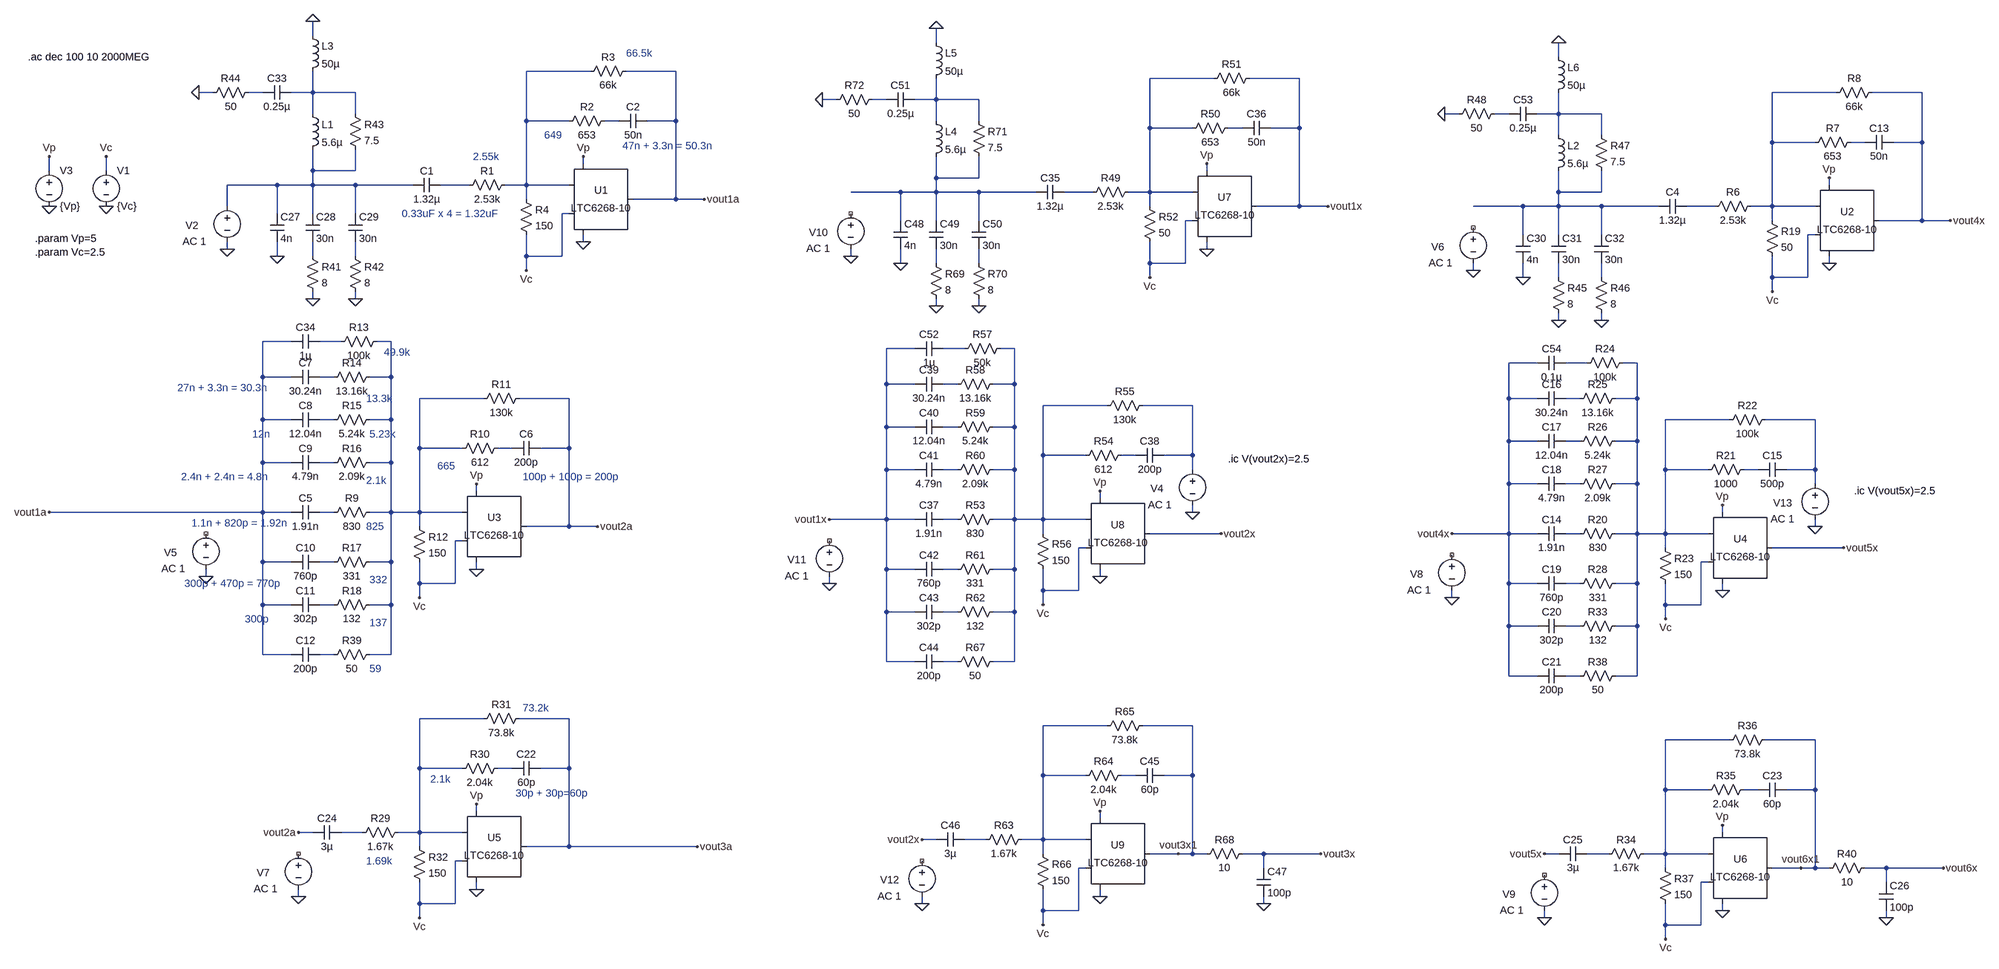
[diagram p0: schematic 3stagecompensator_localloopgainchecks_20211019 - save 1.asc]
3stagecompensator_localloopgainchecks_20211019 - save 1.asc, the LTspice schematic file:
Version 4
SHEET 1 4224 2536
WIRE -400 -304 -400 -336
WIRE 1216 -288 1216 -320
WIRE 2848 -256 2848 -288
WIRE 224 -224 80 -224
WIRE 416 -224 304 -224
WIRE 1840 -208 1696 -208
WIRE 2032 -208 1920 -208
WIRE -624 -176 -656 -176
WIRE -512 -176 -544 -176
WIRE -400 -176 -400 -224
WIRE -400 -176 -448 -176
WIRE -304 -176 -400 -176
WIRE 3472 -176 3328 -176
WIRE 3664 -176 3552 -176
WIRE 992 -160 960 -160
WIRE 1104 -160 1072 -160
WIRE 1216 -160 1216 -208
WIRE 1216 -160 1168 -160
WIRE 1312 -160 1216 -160
WIRE -400 -128 -400 -176
WIRE -304 -128 -304 -176
WIRE 2624 -128 2592 -128
WIRE 2736 -128 2704 -128
WIRE 2848 -128 2848 -176
WIRE 2848 -128 2800 -128
WIRE 2944 -128 2848 -128
WIRE 80 -112 80 -224
WIRE 176 -112 80 -112
WIRE 288 -112 256 -112
WIRE 416 -112 416 -224
WIRE 416 -112 352 -112
WIRE 1216 -112 1216 -160
WIRE 1312 -112 1312 -160
WIRE 1696 -96 1696 -208
WIRE 1792 -96 1696 -96
WIRE 1904 -96 1872 -96
WIRE 2032 -96 2032 -208
WIRE 2032 -96 1968 -96
WIRE 2848 -80 2848 -128
WIRE 2944 -80 2944 -128
WIRE 3328 -64 3328 -176
WIRE 3424 -64 3328 -64
WIRE 3536 -64 3504 -64
WIRE 3664 -64 3664 -176
WIRE 3664 -64 3600 -64
WIRE 208 -16 208 -32
WIRE -992 0 -992 -32
WIRE -864 0 -864 -32
WIRE -400 0 -400 -48
WIRE -304 0 -304 -48
WIRE -304 0 -400 0
WIRE 1824 0 1824 -16
WIRE 1216 16 1216 -32
WIRE 1312 16 1312 -32
WIRE 1312 16 1216 16
WIRE -480 32 -592 32
WIRE -400 32 -400 0
WIRE -400 32 -480 32
WIRE -304 32 -400 32
WIRE -176 32 -304 32
WIRE -48 32 -112 32
WIRE 80 32 80 -112
WIRE 80 32 32 32
WIRE 176 32 80 32
WIRE 3456 32 3456 16
WIRE 1136 48 1024 48
WIRE 1216 48 1216 16
WIRE 1216 48 1136 48
WIRE 1312 48 1216 48
WIRE 1440 48 1312 48
WIRE 1568 48 1504 48
WIRE 1696 48 1696 -96
WIRE 1696 48 1648 48
WIRE 1792 48 1696 48
WIRE 2848 48 2848 0
WIRE 2944 48 2944 0
WIRE 2944 48 2848 48
WIRE 80 64 80 32
WIRE 416 64 416 -112
WIRE 416 64 320 64
WIRE 480 64 416 64
WIRE -592 80 -592 32
WIRE 1696 80 1696 48
WIRE 2032 80 2032 -96
WIRE 2032 80 1936 80
WIRE 2096 80 2032 80
WIRE 2768 80 2656 80
WIRE 2848 80 2848 48
WIRE 2848 80 2768 80
WIRE 2944 80 2848 80
WIRE 3072 80 2944 80
WIRE 3200 80 3136 80
WIRE 3328 80 3328 -64
WIRE 3328 80 3280 80
WIRE 3424 80 3328 80
WIRE -480 96 -480 32
WIRE -400 96 -400 32
WIRE -304 96 -304 32
WIRE 176 96 160 96
WIRE 1136 112 1136 48
WIRE 1216 112 1216 48
WIRE 1312 112 1312 48
WIRE 1792 112 1776 112
WIRE 3328 112 3328 80
WIRE 3664 112 3664 -64
WIRE 3664 112 3568 112
WIRE 3728 112 3664 112
WIRE 2768 144 2768 80
WIRE 2848 144 2848 80
WIRE 2944 144 2944 80
WIRE 3424 144 3408 144
WIRE 208 160 208 144
WIRE -592 176 -592 160
WIRE 1824 176 1824 160
WIRE -480 192 -480 160
WIRE -400 192 -400 160
WIRE -304 192 -304 160
WIRE 80 192 80 144
WIRE 160 192 160 96
WIRE 160 192 80 192
WIRE 1024 192 1024 176
WIRE 1136 208 1136 176
WIRE 1216 208 1216 176
WIRE 1312 208 1312 176
WIRE 1696 208 1696 160
WIRE 1776 208 1776 112
WIRE 1776 208 1696 208
WIRE 3456 208 3456 192
WIRE 80 224 80 192
WIRE 2656 224 2656 208
WIRE 1696 240 1696 208
WIRE 2768 240 2768 208
WIRE 2848 240 2848 208
WIRE 2944 240 2944 208
WIRE 3328 240 3328 192
WIRE 3408 240 3408 144
WIRE 3408 240 3328 240
WIRE 3328 272 3328 240
WIRE -400 288 -400 272
WIRE -304 288 -304 272
WIRE 1216 304 1216 288
WIRE 1312 304 1312 288
WIRE 2848 336 2848 320
WIRE 2944 336 2944 320
WIRE -448 384 -512 384
WIRE -336 384 -384 384
WIRE -224 384 -256 384
WIRE 1168 400 1104 400
WIRE 1280 400 1232 400
WIRE 1392 400 1360 400
WIRE 2800 432 2736 432
WIRE 2912 432 2864 432
WIRE 3024 432 2992 432
WIRE -512 464 -512 384
WIRE -448 464 -512 464
WIRE -352 464 -384 464
WIRE -224 464 -224 384
WIRE -224 464 -272 464
WIRE 1104 480 1104 400
WIRE 1168 480 1104 480
WIRE 1264 480 1232 480
WIRE 1392 480 1392 400
WIRE 1392 480 1344 480
WIRE -16 512 -160 512
WIRE 176 512 64 512
WIRE 2736 512 2736 432
WIRE 2800 512 2736 512
WIRE 2896 512 2864 512
WIRE 3024 512 3024 432
WIRE 3024 512 2976 512
WIRE 1600 528 1456 528
WIRE 1792 528 1680 528
WIRE -512 560 -512 464
WIRE -448 560 -512 560
WIRE -352 560 -384 560
WIRE -224 560 -224 464
WIRE -224 560 -272 560
WIRE 3232 560 3088 560
WIRE 3424 560 3312 560
WIRE 1104 576 1104 480
WIRE 1168 576 1104 576
WIRE 1264 576 1232 576
WIRE 1392 576 1392 480
WIRE 1392 576 1344 576
WIRE 2736 608 2736 512
WIRE 2800 608 2736 608
WIRE 2896 608 2864 608
WIRE 3024 608 3024 512
WIRE 3024 608 2976 608
WIRE -160 624 -160 512
WIRE -64 624 -160 624
WIRE 48 624 16 624
WIRE 176 624 176 512
WIRE 176 624 112 624
WIRE 1456 640 1456 528
WIRE 1552 640 1456 640
WIRE 1664 640 1632 640
WIRE 1792 640 1792 528
WIRE 1792 640 1728 640
WIRE -512 656 -512 560
WIRE -448 656 -512 656
WIRE -352 656 -384 656
WIRE -224 656 -224 560
WIRE -224 656 -272 656
WIRE 1104 672 1104 576
WIRE 1168 672 1104 672
WIRE 1264 672 1232 672
WIRE 1392 672 1392 576
WIRE 1392 672 1344 672
WIRE 1792 672 1792 640
WIRE 3088 672 3088 560
WIRE 3184 672 3088 672
WIRE 3296 672 3264 672
WIRE 3424 672 3424 560
WIRE 3424 672 3360 672
WIRE 2736 704 2736 608
WIRE 2800 704 2736 704
WIRE 2896 704 2864 704
WIRE 3024 704 3024 608
WIRE 3024 704 2976 704
WIRE 3424 704 3424 672
WIRE -32 720 -32 704
WIRE 1584 736 1584 720
WIRE -512 768 -512 656
WIRE -512 768 -992 768
WIRE -448 768 -512 768
WIRE -352 768 -384 768
WIRE -224 768 -224 656
WIRE -224 768 -272 768
WIRE -160 768 -160 624
WIRE -160 768 -224 768
WIRE -64 768 -160 768
WIRE 1792 768 1792 752
WIRE 3216 768 3216 752
WIRE 1104 784 1104 672
WIRE 1104 784 976 784
WIRE 1168 784 1104 784
WIRE 1264 784 1232 784
WIRE 1392 784 1392 672
WIRE 1392 784 1344 784
WIRE 1456 784 1456 640
WIRE 1456 784 1392 784
WIRE 1552 784 1456 784
WIRE -160 800 -160 768
WIRE 176 800 176 624
WIRE 176 800 80 800
WIRE 240 800 176 800
WIRE 3424 800 3424 784
WIRE 1456 816 1456 784
WIRE 1856 816 1696 816
WIRE 2736 816 2736 704
WIRE 2736 816 2608 816
WIRE 2800 816 2736 816
WIRE 2896 816 2864 816
WIRE 3024 816 3024 704
WIRE 3024 816 2976 816
WIRE 3088 816 3088 672
WIRE 3088 816 3024 816
WIRE 3184 816 3088 816
WIRE -64 832 -80 832
WIRE 1552 848 1536 848
WIRE 3088 848 3088 816
WIRE 3488 848 3328 848
WIRE -512 880 -512 768
WIRE -448 880 -512 880
WIRE -352 880 -384 880
WIRE -224 880 -224 768
WIRE -224 880 -272 880
WIRE 3184 880 3168 880
WIRE -32 896 -32 880
WIRE 1104 896 1104 784
WIRE 1168 896 1104 896
WIRE 1264 896 1232 896
WIRE 1392 896 1392 784
WIRE 1392 896 1344 896
WIRE -640 912 -640 896
WIRE 1584 912 1584 896
WIRE -160 928 -160 880
WIRE -80 928 -80 832
WIRE -80 928 -160 928
WIRE 976 928 976 912
WIRE 2736 928 2736 816
WIRE 2800 928 2736 928
WIRE 2896 928 2864 928
WIRE 3024 928 3024 816
WIRE 3024 928 2976 928
WIRE 1456 944 1456 896
WIRE 1536 944 1536 848
WIRE 1536 944 1456 944
WIRE 3216 944 3216 928
WIRE -160 960 -160 928
WIRE 2608 960 2608 944
WIRE -512 976 -512 880
WIRE -448 976 -512 976
WIRE -352 976 -384 976
WIRE -224 976 -224 880
WIRE -224 976 -272 976
WIRE 1456 976 1456 944
WIRE 3088 976 3088 928
WIRE 3168 976 3168 880
WIRE 3168 976 3088 976
WIRE 1104 992 1104 896
WIRE 1168 992 1104 992
WIRE 1264 992 1232 992
WIRE 1392 992 1392 896
WIRE 1392 992 1344 992
WIRE 3088 1008 3088 976
WIRE 2736 1024 2736 928
WIRE 2800 1024 2736 1024
WIRE 2896 1024 2864 1024
WIRE 3024 1024 3024 928
WIRE 3024 1024 2976 1024
WIRE -512 1088 -512 976
WIRE -448 1088 -512 1088
WIRE -352 1088 -384 1088
WIRE -224 1088 -224 976
WIRE -224 1088 -272 1088
WIRE 1104 1104 1104 992
WIRE 1168 1104 1104 1104
WIRE 1264 1104 1232 1104
WIRE 1392 1104 1392 992
WIRE 1392 1104 1344 1104
WIRE 2736 1136 2736 1024
WIRE 2800 1136 2736 1136
WIRE 2896 1136 2864 1136
WIRE 3024 1136 3024 1024
WIRE 3024 1136 2976 1136
WIRE -16 1232 -160 1232
WIRE 176 1232 64 1232
WIRE 1600 1248 1456 1248
WIRE 1792 1248 1680 1248
WIRE 3232 1280 3088 1280
WIRE 3424 1280 3312 1280
WIRE -160 1344 -160 1232
WIRE -64 1344 -160 1344
WIRE 48 1344 16 1344
WIRE 176 1344 176 1232
WIRE 176 1344 112 1344
WIRE 1456 1360 1456 1248
WIRE 1552 1360 1456 1360
WIRE 1664 1360 1632 1360
WIRE 1792 1360 1792 1248
WIRE 1792 1360 1728 1360
WIRE 3088 1392 3088 1280
WIRE 3184 1392 3088 1392
WIRE 3296 1392 3264 1392
WIRE 3424 1392 3424 1280
WIRE 3424 1392 3360 1392
WIRE -32 1440 -32 1424
WIRE 1584 1456 1584 1440
WIRE -400 1488 -432 1488
WIRE -288 1488 -336 1488
WIRE -160 1488 -160 1344
WIRE -160 1488 -208 1488
WIRE -64 1488 -160 1488
WIRE 3216 1488 3216 1472
WIRE 1216 1504 1184 1504
WIRE 1328 1504 1280 1504
WIRE 1456 1504 1456 1360
WIRE 1456 1504 1408 1504
WIRE 1552 1504 1456 1504
WIRE -160 1520 -160 1488
WIRE 176 1520 176 1344
WIRE 176 1520 80 1520
WIRE 464 1520 176 1520
WIRE 1456 1536 1456 1504
WIRE 1760 1536 1696 1536
WIRE 1792 1536 1792 1360
WIRE 1792 1536 1760 1536
WIRE 1824 1536 1792 1536
WIRE 1952 1536 1904 1536
WIRE 2080 1536 1952 1536
WIRE 2848 1536 2816 1536
WIRE 2960 1536 2912 1536
WIRE 3088 1536 3088 1392
WIRE 3088 1536 3040 1536
WIRE 3184 1536 3088 1536
WIRE -64 1552 -80 1552
WIRE 1552 1568 1536 1568
WIRE 1952 1568 1952 1536
WIRE 3088 1568 3088 1536
WIRE 3392 1568 3328 1568
WIRE 3424 1568 3424 1392
WIRE 3424 1568 3392 1568
WIRE 3456 1568 3424 1568
WIRE 3584 1568 3536 1568
WIRE 3712 1568 3584 1568
WIRE 3184 1600 3168 1600
WIRE 3584 1600 3584 1568
WIRE -32 1616 -32 1600
WIRE -432 1632 -432 1616
WIRE 1584 1632 1584 1616
WIRE -160 1648 -160 1600
WIRE -80 1648 -80 1552
WIRE -80 1648 -160 1648
WIRE 1184 1648 1184 1632
WIRE 1952 1648 1952 1632
WIRE 1456 1664 1456 1616
WIRE 1536 1664 1536 1568
WIRE 1536 1664 1456 1664
WIRE 3216 1664 3216 1648
WIRE -160 1680 -160 1648
WIRE 2816 1680 2816 1664
WIRE 3584 1680 3584 1664
WIRE 1456 1696 1456 1664
WIRE 3088 1696 3088 1648
WIRE 3168 1696 3168 1600
WIRE 3168 1696 3088 1696
WIRE 3088 1728 3088 1696
FLAG 208 160 0
FLAG -992 80 0
FLAG 480 64 vout1a
FLAG -992 -32 Vp
FLAG -864 80 0
FLAG -864 -32 Vc
FLAG 208 -32 Vp
FLAG -592 176 0
FLAG 80 224 Vc
FLAG -32 896 0
FLAG 240 800 vout2a
FLAG -32 704 Vp
FLAG -640 912 0
FLAG -160 960 Vc
FLAG -32 1616 0
FLAG 464 1520 vout3a
FLAG -32 1424 Vp
FLAG -432 1632 0
FLAG -160 1680 Vc
FLAG -304 288 0
FLAG -400 288 0
FLAG -480 192 0
FLAG -656 -176 0
FLAG -400 -336 0
FLAG 1824 176 0
FLAG 2096 80 vout1x
FLAG 1824 -16 Vp
FLAG 1024 192 0
FLAG 1696 240 Vc
FLAG 1584 912 0
FLAG 1856 816 vout2x
FLAG 1584 720 Vp
FLAG 976 928 0
FLAG 1456 976 Vc
FLAG 1584 1632 0
FLAG 2080 1536 vout3x
FLAG 1584 1440 Vp
FLAG 1184 1648 0
FLAG 1456 1696 Vc
FLAG 1952 1648 0
FLAG 1312 304 0
FLAG 1216 304 0
FLAG 1136 208 0
FLAG 960 -160 0
FLAG 1216 -320 0
FLAG -992 768 vout1a
FLAG -432 1488 vout2a
FLAG 1792 768 0
FLAG 976 784 vout1x
FLAG 1184 1504 vout2x
FLAG 1760 1536 vout3x1
FLAG 3456 208 0
FLAG 3728 112 vout4x
FLAG 3456 16 Vp
FLAG 2656 224 0
FLAG 3328 272 Vc
FLAG 3216 944 0
FLAG 3488 848 vout5x
FLAG 3216 752 Vp
FLAG 2608 960 0
FLAG 3088 1008 Vc
FLAG 3216 1664 0
FLAG 3712 1568 vout6x
FLAG 3216 1472 Vp
FLAG 2816 1680 0
FLAG 3088 1728 Vc
FLAG 3584 1680 0
FLAG 2944 336 0
FLAG 2848 336 0
FLAG 2768 240 0
FLAG 2592 -128 0
FLAG 2848 -288 0
FLAG 3424 800 0
FLAG 2608 816 vout4x
FLAG 2816 1536 vout5x
FLAG 3392 1568 vout6x1
SYMBOL Opamps\\LTC6268-10 208 64 R0
SYMATTR InstName U1
SYMBOL voltage -992 -16 R0
WINDOW 123 0 0 Left 2
WINDOW 39 0 0 Left 2
SYMATTR InstName V3
SYMATTR Value {Vp}
SYMBOL voltage -864 -16 R0
WINDOW 123 0 0 Left 2
WINDOW 39 0 0 Left 2
SYMATTR InstName V1
SYMATTR Value {Vc}
SYMBOL res -64 48 R270
WINDOW 0 32 56 VTop 2
WINDOW 3 0 56 VBottom 2
SYMATTR InstName R1
SYMATTR Value 2.53k
SYMBOL cap -112 16 R90
WINDOW 0 0 32 VBottom 2
WINDOW 3 32 32 VTop 2
SYMATTR InstName C1
SYMATTR Value 1.32µ
SYMBOL res 272 -128 R90
WINDOW 0 0 56 VBottom 2
WINDOW 3 32 56 VTop 2
SYMATTR InstName R2
SYMATTR Value 653
SYMBOL res 320 -240 R90
WINDOW 0 0 56 VBottom 2
WINDOW 3 32 56 VTop 2
SYMATTR InstName R3
SYMATTR Value 66k
SYMBOL cap 352 -128 R90
WINDOW 0 0 32 VBottom 2
WINDOW 3 32 32 VTop 2
SYMATTR InstName C2
SYMATTR Value 50n
SYMBOL voltage -592 64 R0
WINDOW 0 -94 59 Left 2
WINDOW 123 -100 95 Left 2
WINDOW 39 0 0 Left 0
SYMATTR InstName V2
SYMATTR Value2 AC 1
SYMATTR Value ""
SYMBOL res 64 48 R0
SYMATTR InstName R4
SYMATTR Value 150
SYMBOL Opamps\\LTC6268-10 -32 800 R0
SYMATTR InstName U3
SYMBOL res -368 784 R270
WINDOW 0 32 56 VTop 2
WINDOW 3 0 56 VBottom 2
SYMATTR InstName R9
SYMATTR Value 830
SYMBOL cap -384 752 R90
WINDOW 0 0 32 VBottom 2
WINDOW 3 32 32 VTop 2
SYMATTR InstName C5
SYMATTR Value 1.91n
SYMBOL res 32 608 R90
WINDOW 0 0 56 VBottom 2
WINDOW 3 32 56 VTop 2
SYMATTR InstName R10
SYMATTR Value 612
SYMBOL res 80 496 R90
WINDOW 0 0 56 VBottom 2
WINDOW 3 32 56 VTop 2
SYMATTR InstName R11
SYMATTR Value 130k
SYMBOL cap 112 608 R90
WINDOW 0 0 32 VBottom 2
WINDOW 3 32 32 VTop 2
SYMATTR InstName C6
SYMATTR Value 200p
SYMBOL voltage -640 800 R0
WINDOW 0 -94 59 Left 2
WINDOW 123 -100 95 Left 2
WINDOW 39 0 0 Left 0
SYMATTR InstName V5
SYMATTR Value2 AC 1
SYMATTR Value ""
SYMBOL res -176 784 R0
SYMATTR InstName R12
SYMATTR Value 150
SYMBOL res -240 368 R90
WINDOW 0 0 56 VBottom 2
WINDOW 3 32 56 VTop 2
SYMATTR InstName R13
SYMATTR Value 100k
SYMBOL res -368 480 R270
WINDOW 0 32 56 VTop 2
WINDOW 3 0 56 VBottom 2
SYMATTR InstName R14
SYMATTR Value 13.16k
SYMBOL cap -384 448 R90
WINDOW 0 0 32 VBottom 2
WINDOW 3 32 32 VTop 2
SYMATTR InstName C7
SYMATTR Value 30.24n
SYMBOL res -368 576 R270
WINDOW 0 32 56 VTop 2
WINDOW 3 0 56 VBottom 2
SYMATTR InstName R15
SYMATTR Value 5.24k
SYMBOL cap -384 544 R90
WINDOW 0 0 32 VBottom 2
WINDOW 3 32 32 VTop 2
SYMATTR InstName C8
SYMATTR Value 12.04n
SYMBOL res -368 672 R270
WINDOW 0 32 56 VTop 2
WINDOW 3 0 56 VBottom 2
SYMATTR InstName R16
SYMATTR Value 2.09k
SYMBOL cap -384 640 R90
WINDOW 0 0 32 VBottom 2
WINDOW 3 32 32 VTop 2
SYMATTR InstName C9
SYMATTR Value 4.79n
SYMBOL res -368 896 R270
WINDOW 0 32 56 VTop 2
WINDOW 3 0 56 VBottom 2
SYMATTR InstName R17
SYMATTR Value 331
SYMBOL cap -384 864 R90
WINDOW 0 0 32 VBottom 2
WINDOW 3 32 32 VTop 2
SYMATTR InstName C10
SYMATTR Value 760p
SYMBOL res -368 992 R270
WINDOW 0 32 56 VTop 2
WINDOW 3 0 56 VBottom 2
SYMATTR InstName R18
SYMATTR Value 132
SYMBOL cap -384 960 R90
WINDOW 0 0 32 VBottom 2
WINDOW 3 32 32 VTop 2
SYMATTR InstName C11
SYMATTR Value 302p
SYMBOL cap -384 1072 R90
WINDOW 0 0 32 VBottom 2
WINDOW 3 32 32 VTop 2
SYMATTR InstName C12
SYMATTR Value 200p
SYMBOL Opamps\\LTC6268-10 -32 1520 R0
SYMATTR InstName U5
SYMBOL res -304 1504 R270
WINDOW 0 32 56 VTop 2
WINDOW 3 0 56 VBottom 2
SYMATTR InstName R29
SYMATTR Value 1.67k
SYMBOL res 32 1328 R90
WINDOW 0 0 56 VBottom 2
WINDOW 3 32 56 VTop 2
SYMATTR InstName R30
SYMATTR Value 2.04k
SYMBOL res 80 1216 R90
WINDOW 0 0 56 VBottom 2
WINDOW 3 32 56 VTop 2
SYMATTR InstName R31
SYMATTR Value 73.8k
SYMBOL cap 112 1328 R90
WINDOW 0 0 32 VBottom 2
WINDOW 3 32 32 VTop 2
SYMATTR InstName C22
SYMATTR Value 60p
SYMBOL voltage -432 1520 R0
WINDOW 0 -94 59 Left 2
WINDOW 123 -100 95 Left 2
WINDOW 39 0 0 Left 0
SYMATTR InstName V7
SYMATTR Value2 AC 1
SYMATTR Value ""
SYMBOL res -176 1504 R0
SYMATTR InstName R32
SYMATTR Value 150
SYMBOL res -368 1104 R270
WINDOW 0 32 56 VTop 2
WINDOW 3 0 56 VBottom 2
SYMATTR InstName R39
SYMATTR Value 50
SYMBOL cap -336 1472 R90
WINDOW 0 0 32 VBottom 2
WINDOW 3 32 32 VTop 2
SYMATTR InstName C24
SYMATTR Value 3µ
SYMBOL cap -496 96 R0
SYMATTR InstName C27
SYMATTR Value 4n
SYMBOL cap -416 96 R0
SYMATTR InstName C28
SYMATTR Value 30n
SYMBOL res -416 176 R0
SYMATTR InstName R41
SYMATTR Value 8
SYMBOL cap -320 96 R0
SYMATTR InstName C29
SYMATTR Value 30n
SYMBOL res -320 176 R0
SYMATTR InstName R42
SYMATTR Value 8
SYMBOL ind -416 -144 R0
SYMATTR InstName L1
SYMATTR Value 5.6µ
SYMBOL res -320 -144 R0
SYMATTR InstName R43
SYMATTR Value 7.5
SYMBOL res -640 -160 R270
WINDOW 0 32 56 VTop 2
WINDOW 3 0 56 VBottom 2
SYMATTR InstName R44
SYMATTR Value 50
SYMBOL ind -416 -320 R0
SYMATTR InstName L3
SYMATTR Value 50µ
SYMBOL cap -448 -192 R90
WINDOW 0 0 32 VBottom 2
WINDOW 3 32 32 VTop 2
SYMATTR InstName C33
SYMATTR Value 0.25µ
SYMBOL cap -384 368 R90
WINDOW 0 0 32 VBottom 2
WINDOW 3 32 32 VTop 2
SYMATTR InstName C34
SYMATTR Value 1µ
SYMBOL Opamps\\LTC6268-10 1824 80 R0
SYMATTR InstName U7
SYMBOL res 1552 64 R270
WINDOW 0 32 56 VTop 2
WINDOW 3 0 56 VBottom 2
SYMATTR InstName R49
SYMATTR Value 2.53k
SYMBOL cap 1504 32 R90
WINDOW 0 0 32 VBottom 2
WINDOW 3 32 32 VTop 2
SYMATTR InstName C35
SYMATTR Value 1.32µ
SYMBOL res 1888 -112 R90
WINDOW 0 0 56 VBottom 2
WINDOW 3 32 56 VTop 2
SYMATTR InstName R50
SYMATTR Value 653
SYMBOL res 1936 -224 R90
WINDOW 0 0 56 VBottom 2
WINDOW 3 32 56 VTop 2
SYMATTR InstName R51
SYMATTR Value 66k
SYMBOL cap 1968 -112 R90
WINDOW 0 0 32 VBottom 2
WINDOW 3 32 32 VTop 2
SYMATTR InstName C36
SYMATTR Value 50n
SYMBOL voltage 1024 80 R0
WINDOW 0 -94 59 Left 2
WINDOW 123 -100 95 Left 2
WINDOW 39 0 0 Left 0
SYMATTR InstName V10
SYMATTR Value2 AC 1
SYMATTR Value ""
SYMBOL res 1680 64 R0
SYMATTR InstName R52
SYMATTR Value 50
SYMBOL Opamps\\LTC6268-10 1584 816 R0
SYMATTR InstName U8
SYMBOL res 1248 800 R270
WINDOW 0 32 56 VTop 2
WINDOW 3 0 56 VBottom 2
SYMATTR InstName R53
SYMATTR Value 830
SYMBOL cap 1232 768 R90
WINDOW 0 0 32 VBottom 2
WINDOW 3 32 32 VTop 2
SYMATTR InstName C37
SYMATTR Value 1.91n
SYMBOL res 1648 624 R90
WINDOW 0 0 56 VBottom 2
WINDOW 3 32 56 VTop 2
SYMATTR InstName R54
SYMATTR Value 612
SYMBOL res 1696 512 R90
WINDOW 0 0 56 VBottom 2
WINDOW 3 32 56 VTop 2
SYMATTR InstName R55
SYMATTR Value 130k
SYMBOL cap 1728 624 R90
WINDOW 0 0 32 VBottom 2
WINDOW 3 32 32 VTop 2
SYMATTR InstName C38
SYMATTR Value 200p
SYMBOL voltage 976 816 R0
WINDOW 0 -94 59 Left 2
WINDOW 123 -100 95 Left 2
WINDOW 39 0 0 Left 0
SYMATTR InstName V11
SYMATTR Value2 AC 1
SYMATTR Value ""
SYMBOL res 1440 800 R0
SYMATTR InstName R56
SYMATTR Value 150
SYMBOL res 1376 384 R90
WINDOW 0 0 56 VBottom 2
WINDOW 3 32 56 VTop 2
SYMATTR InstName R57
SYMATTR Value 50k
SYMBOL res 1248 496 R270
WINDOW 0 32 56 VTop 2
WINDOW 3 0 56 VBottom 2
SYMATTR InstName R58
SYMATTR Value 13.16k
SYMBOL cap 1232 464 R90
WINDOW 0 0 32 VBottom 2
WINDOW 3 32 32 VTop 2
SYMATTR InstName C39
SYMATTR Value 30.24n
SYMBOL res 1248 592 R270
WINDOW 0 32 56 VTop 2
WINDOW 3 0 56 VBottom 2
SYMATTR InstName R59
SYMATTR Value 5.24k
SYMBOL cap 1232 560 R90
WINDOW 0 0 32 VBottom 2
WINDOW 3 32 32 VTop 2
SYMATTR InstName C40
SYMATTR Value 12.04n
SYMBOL res 1248 688 R270
WINDOW 0 32 56 VTop 2
WINDOW 3 0 56 VBottom 2
SYMATTR InstName R60
SYMATTR Value 2.09k
SYMBOL cap 1232 656 R90
WINDOW 0 0 32 VBottom 2
WINDOW 3 32 32 VTop 2
SYMATTR InstName C41
SYMATTR Value 4.79n
SYMBOL res 1248 912 R270
WINDOW 0 32 56 VTop 2
WINDOW 3 0 56 VBottom 2
SYMATTR InstName R61
SYMATTR Value 331
SYMBOL cap 1232 880 R90
WINDOW 0 0 32 VBottom 2
WINDOW 3 32 32 VTop 2
SYMATTR InstName C42
SYMATTR Value 760p
SYMBOL res 1248 1008 R270
WINDOW 0 32 56 VTop 2
WINDOW 3 0 56 VBottom 2
SYMATTR InstName R62
SYMATTR Value 132
SYMBOL cap 1232 976 R90
WINDOW 0 0 32 VBottom 2
WINDOW 3 32 32 VTop 2
SYMATTR InstName C43
SYMATTR Value 302p
SYMBOL cap 1232 1088 R90
WINDOW 0 0 32 VBottom 2
WINDOW 3 32 32 VTop 2
SYMATTR InstName C44
SYMATTR Value 200p
SYMBOL Opamps\\LTC6268-10 1584 1536 R0
SYMATTR InstName U9
SYMBOL res 1312 1520 R270
WINDOW 0 32 56 VTop 2
WINDOW 3 0 56 VBottom 2
SYMATTR InstName R63
SYMATTR Value 1.67k
SYMBOL res 1648 1344 R90
WINDOW 0 0 56 VBottom 2
WINDOW 3 32 56 VTop 2
SYMATTR InstName R64
SYMATTR Value 2.04k
SYMBOL res 1696 1232 R90
WINDOW 0 0 56 VBottom 2
WINDOW 3 32 56 VTop 2
SYMATTR InstName R65
SYMATTR Value 73.8k
SYMBOL cap 1728 1344 R90
WINDOW 0 0 32 VBottom 2
WINDOW 3 32 32 VTop 2
SYMATTR InstName C45
SYMATTR Value 60p
SYMBOL voltage 1184 1536 R0
WINDOW 0 -94 59 Left 2
WINDOW 123 -100 95 Left 2
WINDOW 39 0 0 Left 0
SYMATTR InstName V12
SYMATTR Value2 AC 1
SYMATTR Value ""
SYMBOL res 1440 1520 R0
SYMATTR InstName R66
SYMATTR Value 150
SYMBOL res 1248 1120 R270
WINDOW 0 32 56 VTop 2
WINDOW 3 0 56 VBottom 2
SYMATTR InstName R67
SYMATTR Value 50
SYMBOL cap 1280 1488 R90
WINDOW 0 0 32 VBottom 2
WINDOW 3 32 32 VTop 2
SYMATTR InstName C46
SYMATTR Value 3µ
SYMBOL res 1920 1520 R90
WINDOW 0 0 56 VBottom 2
WINDOW 3 32 56 VTop 2
SYMATTR InstName R68
SYMATTR Value 10
SYMBOL cap 1936 1568 R0
SYMATTR InstName C47
SYMATTR Value 100p
SYMBOL cap 1120 112 R0
SYMATTR InstName C48
SYMATTR Value 4n
SYMBOL cap 1200 112 R0
SYMATTR InstName C49
SYMATTR Value 30n
SYMBOL res 1200 192 R0
SYMATTR InstName R69
SYMATTR Value 8
SYMBOL cap 1296 112 R0
SYMATTR InstName C50
SYMATTR Value 30n
SYMBOL res 1296 192 R0
SYMATTR InstName R70
SYMATTR Value 8
SYMBOL ind 1200 -128 R0
SYMATTR InstName L4
SYMATTR Value 5.6µ
SYMBOL res 1296 -128 R0
SYMATTR InstName R71
SYMATTR Value 7.5
SYMBOL res 976 -144 R270
WINDOW 0 32 56 VTop 2
WINDOW 3 0 56 VBottom 2
SYMATTR InstName R72
SYMATTR Value 50
SYMBOL ind 1200 -304 R0
SYMATTR InstName L5
SYMATTR Value 50µ
SYMBOL cap 1168 -176 R90
WINDOW 0 0 32 VBottom 2
WINDOW 3 32 32 VTop 2
SYMATTR InstName C51
SYMATTR Value 0.25µ
SYMBOL cap 1232 384 R90
WINDOW 0 0 32 VBottom 2
WINDOW 3 32 32 VTop 2
SYMATTR InstName C52
SYMATTR Value 1µ
SYMBOL voltage 1792 656 R0
WINDOW 0 -94 59 Left 2
WINDOW 123 -100 95 Left 2
WINDOW 39 0 0 Left 0
SYMATTR InstName V4
SYMATTR Value2 AC 1
SYMATTR Value ""
SYMBOL Opamps\\LTC6268-10 3456 112 R0
SYMATTR InstName U2
SYMBOL res 3184 96 R270
WINDOW 0 32 56 VTop 2
WINDOW 3 0 56 VBottom 2
SYMATTR InstName R6
SYMATTR Value 2.53k
SYMBOL cap 3136 64 R90
WINDOW 0 0 32 VBottom 2
WINDOW 3 32 32 VTop 2
SYMATTR InstName C4
SYMATTR Value 1.32µ
SYMBOL res 3520 -80 R90
WINDOW 0 0 56 VBottom 2
WINDOW 3 32 56 VTop 2
SYMATTR InstName R7
SYMATTR Value 653
SYMBOL res 3568 -192 R90
WINDOW 0 0 56 VBottom 2
WINDOW 3 32 56 VTop 2
SYMATTR InstName R8
SYMATTR Value 66k
SYMBOL cap 3600 -80 R90
WINDOW 0 0 32 VBottom 2
WINDOW 3 32 32 VTop 2
SYMATTR InstName C13
SYMATTR Value 50n
SYMBOL voltage 2656 112 R0
WINDOW 0 -94 59 Left 2
WINDOW 123 -100 95 Left 2
WINDOW 39 0 0 Left 0
SYMATTR InstName V6
SYMATTR Value2 AC 1
SYMATTR Value ""
SYMBOL res 3312 96 R0
SYMATTR InstName R19
SYMATTR Value 50
SYMBOL Opamps\\LTC6268-10 3216 848 R0
SYMATTR InstName U4
SYMBOL res 2880 832 R270
WINDOW 0 32 56 VTop 2
WINDOW 3 0 56 VBottom 2
SYMATTR InstName R20
SYMATTR Value 830
SYMBOL cap 2864 800 R90
WINDOW 0 0 32 VBottom 2
WINDOW 3 32 32 VTop 2
SYMATTR InstName C14
SYMATTR Value 1.91n
SYMBOL res 3280 656 R90
WINDOW 0 0 56 VBottom 2
WINDOW 3 32 56 VTop 2
SYMATTR InstName R21
SYMATTR Value 1000
SYMBOL res 3328 544 R90
WINDOW 0 0 56 VBottom 2
WINDOW 3 32 56 VTop 2
SYMATTR InstName R22
SYMATTR Value 100k
SYMBOL cap 3360 656 R90
WINDOW 0 0 32 VBottom 2
WINDOW 3 32 32 VTop 2
SYMATTR InstName C15
SYMATTR Value 500p
SYMBOL voltage 2608 848 R0
WINDOW 0 -94 59 Left 2
WINDOW 123 -100 95 Left 2
WINDOW 39 0 0 Left 0
SYMATTR InstName V8
SYMATTR Value2 AC 1
SYMATTR Value ""
SYMBOL res 3072 832 R0
SYMATTR InstName R23
SYMATTR Value 150
SYMBOL res 3008 416 R90
WINDOW 0 0 56 VBottom 2
WINDOW 3 32 56 VTop 2
SYMATTR InstName R24
SYMATTR Value 100k
SYMBOL res 2880 528 R270
WINDOW 0 32 56 VTop 2
WINDOW 3 0 56 VBottom 2
SYMATTR InstName R25
SYMATTR Value 13.16k
SYMBOL cap 2864 496 R90
WINDOW 0 0 32 VBottom 2
WINDOW 3 32 32 VTop 2
SYMATTR InstName C16
SYMATTR Value 30.24n
SYMBOL res 2880 624 R270
WINDOW 0 32 56 VTop 2
WINDOW 3 0 56 VBottom 2
SYMATTR InstName R26
SYMATTR Value 5.24k
SYMBOL cap 2864 592 R90
WINDOW 0 0 32 VBottom 2
WINDOW 3 32 32 VTop 2
SYMATTR InstName C17
SYMATTR Value 12.04n
SYMBOL res 2880 720 R270
WINDOW 0 32 56 VTop 2
WINDOW 3 0 56 VBottom 2
SYMATTR InstName R27
SYMATTR Value 2.09k
SYMBOL cap 2864 688 R90
WINDOW 0 0 32 VBottom 2
WINDOW 3 32 32 VTop 2
SYMATTR InstName C18
SYMATTR Value 4.79n
SYMBOL res 2880 944 R270
WINDOW 0 32 56 VTop 2
WINDOW 3 0 56 VBottom 2
SYMATTR InstName R28
SYMATTR Value 331
SYMBOL cap 2864 912 R90
WINDOW 0 0 32 VBottom 2
WINDOW 3 32 32 VTop 2
SYMATTR InstName C19
SYMATTR Value 760p
SYMBOL res 2880 1040 R270
WINDOW 0 32 56 VTop 2
WINDOW 3 0 56 VBottom 2
SYMATTR InstName R33
SYMATTR Value 132
SYMBOL cap 2864 1008 R90
WINDOW 0 0 32 VBottom 2
WINDOW 3 32 32 VTop 2
SYMATTR InstName C20
SYMATTR Value 302p
SYMBOL cap 2864 1120 R90
WINDOW 0 0 32 VBottom 2
WINDOW 3 32 32 VTop 2
SYMATTR InstName C21
SYMATTR Value 200p
SYMBOL Opamps\\LTC6268-10 3216 1568 R0
SYMATTR InstName U6
SYMBOL res 2944 1552 R270
WINDOW 0 32 56 VTop 2
WINDOW 3 0 56 VBottom 2
SYMATTR InstName R34
SYMATTR Value 1.67k
SYMBOL res 3280 1376 R90
WINDOW 0 0 56 VBottom 2
WINDOW 3 32 56 VTop 2
SYMATTR InstName R35
SYMATTR Value 2.04k
SYMBOL res 3328 1264 R90
WINDOW 0 0 56 VBottom 2
WINDOW 3 32 56 VTop 2
SYMATTR InstName R36
SYMATTR Value 73.8k
SYMBOL cap 3360 1376 R90
WINDOW 0 0 32 VBottom 2
WINDOW 3 32 32 VTop 2
SYMATTR InstName C23
SYMATTR Value 60p
SYMBOL voltage 2816 1568 R0
WINDOW 0 -94 59 Left 2
WINDOW 123 -100 95 Left 2
WINDOW 39 0 0 Left 0
SYMATTR InstName V9
SYMATTR Value2 AC 1
SYMATTR Value ""
SYMBOL res 3072 1552 R0
SYMATTR InstName R37
SYMATTR Value 150
SYMBOL res 2880 1152 R270
WINDOW 0 32 56 VTop 2
WINDOW 3 0 56 VBottom 2
SYMATTR InstName R38
SYMATTR Value 50
SYMBOL cap 2912 1520 R90
WINDOW 0 0 32 VBottom 2
WINDOW 3 32 32 VTop 2
SYMATTR InstName C25
SYMATTR Value 3µ
SYMBOL res 3552 1552 R90
WINDOW 0 0 56 VBottom 2
WINDOW 3 32 56 VTop 2
SYMATTR InstName R40
SYMATTR Value 10
SYMBOL cap 3568 1600 R0
SYMATTR InstName C26
SYMATTR Value 100p
SYMBOL cap 2752 144 R0
SYMATTR InstName C30
SYMATTR Value 4n
SYMBOL cap 2832 144 R0
SYMATTR InstName C31
SYMATTR Value 30n
SYMBOL res 2832 224 R0
SYMATTR InstName R45
SYMATTR Value 8
SYMBOL cap 2928 144 R0
SYMATTR InstName C32
SYMATTR Value 30n
SYMBOL res 2928 224 R0
SYMATTR InstName R46
SYMATTR Value 8
SYMBOL ind 2832 -96 R0
SYMATTR InstName L2
SYMATTR Value 5.6µ
SYMBOL res 2928 -96 R0
SYMATTR InstName R47
SYMATTR Value 7.5
SYMBOL res 2608 -112 R270
WINDOW 0 32 56 VTop 2
WINDOW 3 0 56 VBottom 2
SYMATTR InstName R48
SYMATTR Value 50
SYMBOL ind 2832 -272 R0
SYMATTR InstName L6
SYMATTR Value 50µ
SYMBOL cap 2800 -144 R90
WINDOW 0 0 32 VBottom 2
WINDOW 3 32 32 VTop 2
SYMATTR InstName C53
SYMATTR Value 0.25µ
SYMBOL cap 2864 416 R90
WINDOW 0 0 32 VBottom 2
WINDOW 3 32 32 VTop 2
SYMATTR InstName C54
SYMATTR Value 0.1µ
SYMBOL voltage 3424 688 R0
WINDOW 0 -94 59 Left 2
WINDOW 123 -100 95 Left 2
WINDOW 39 0 0 Left 0
SYMATTR InstName V13
SYMATTR Value2 AC 1
SYMATTR Value ""
TEXT -1040 -256 Left 2 !.ac dec 100 10 2000MEG
TEXT -1024 152 Left 2 !.param Vp=5\n.param Vc=2.5
TEXT 1872 648 Left 2 !.ic V(vout2x)=2.5
TEXT -40 -32 Left 2 ;2.55k
TEXT 120 -80 Left 2 ;649
TEXT 304 -264 Left 2 ;66.5k
TEXT 296 -56 Left 2 ;47n + 3.3n = 50.3n
TEXT 72 688 Left 2 ;100p + 100p = 200p
TEXT -120 664 Left 2 ;665
TEXT -240 408 Left 2 ;49.9k
TEXT -280 512 Left 2 ;13.3k
TEXT -272 592 Left 2 ;5.23k
TEXT -280 696 Left 2 ;2.1k
TEXT -280 800 Left 2 ;825
TEXT -272 920 Left 2 ;332
TEXT -272 1016 Left 2 ;137
TEXT -272 1120 Left 2 ;59
TEXT -704 488 Left 2 ;27n + 3.3n = 30.3n
TEXT -536 592 Left 2 ;12n
TEXT -696 688 Left 2 ;2.4n + 2.4n = 4.8n
TEXT -672 792 Left 2 ;1.1n + 820p = 1.92n
TEXT -688 928 Left 2 ;300p + 470p = 770p
TEXT -552 1008 Left 2 ;300p
TEXT -280 1552 Left 2 ;1.69k
TEXT -136 1368 Left 2 ;2.1k
TEXT 56 1400 Left 2 ;30p + 30p=60p
TEXT 72 1208 Left 2 ;73.2k
TEXT -200 96 Left 2 ;0.33uF x 4 = 1.32uF
TEXT 3512 720 Left 2 !.ic V(vout5x)=2.5

The netlist it stands for:
* 3stagecompensator_localloopgainchecks_20211019 - save 1.asc
XU1 Vc N001 vout1a Vp 0 NC_01 LTC6268-10
V3 Vp 0 {Vp}
V1 Vc 0 {Vc}
R1 N015 N001 2.53k
C1 N015 N013 1.32µ
R2 N010 N001 653
R3 vout1a N001 66k
C2 vout1a N010 50n
V2 N013 0 AC 1
R4 N001 Vc 150
XU3 Vc N026 vout2a Vp 0 NC_02 LTC6268-10
R9 N045 N026 830
C5 N045 vout1a 1.91n
R10 N039 N026 612
R11 vout2a N026 130k
C6 vout2a N039 200p
V5 NC_03 0 AC 1
R12 N026 Vc 150
R13 N026 N025 100k
R14 N031 N026 13.16k
C7 N031 vout1a 30.24n
R15 N035 N026 5.24k
C8 N035 vout1a 12.04n
R16 N041 N026 2.09k
C9 N041 vout1a 4.79n
R17 N048 N026 331
C10 N048 vout1a 760p
R18 N051 N026 132
C11 N051 vout1a 302p
C12 N054 vout1a 200p
XU5 Vc N057 vout3a Vp 0 NC_04 LTC6268-10
R29 N063 N057 1.67k
R30 N060 N057 2.04k
R31 vout3a N057 73.8k
C22 vout3a N060 60p
V7 NC_05 0 AC 1
R32 N057 Vc 150
R39 N054 N026 50
C24 N063 vout2a 3µ
C27 N013 0 4n
C28 N013 N019 30n
R41 N019 0 8
C29 N013 N020 30n
R42 N020 0 8
L1 N004 N013 5.6µ
R43 N004 N013 7.5
R44 0 N003 50
L3 0 N004 50µ
C33 N004 N003 0.25µ
C34 N025 vout1a 1µ
XU7 Vc N002 vout1x Vp 0 NC_06 LTC6268-10
R49 N016 N002 2.53k
C35 N016 N014 1.32µ
R50 N011 N002 653
R51 vout1x N002 66k
C36 vout1x N011 50n
V10 NC_07 0 AC 1
R52 N002 Vc 50
XU8 Vc N028 vout2x Vp 0 NC_08 LTC6268-10
R53 N046 N028 830
C37 N046 vout1x 1.91n
R54 N040 N028 612
R55 N034 N028 130k
C38 N034 N040 200p
V11 NC_09 0 AC 1
R56 N028 Vc 150
R57 N028 N027 50k
R58 N032 N028 13.16k
C39 N032 vout1x 30.24n
R59 N037 N028 5.24k
C40 N037 vout1x 12.04n
R60 N042 N028 2.09k
C41 N042 vout1x 4.79n
R61 N049 N028 331
C42 N049 vout1x 760p
R62 N052 N028 132
C43 N052 vout1x 302p
C44 N055 vout1x 200p
XU9 Vc N058 vout3x1 Vp 0 NC_10 LTC6268-10
R63 N064 N058 1.67k
R64 N061 N058 2.04k
R65 vout3x1 N058 73.8k
C45 vout3x1 N061 60p
V12 NC_11 0 AC 1
R66 N058 Vc 150
R67 N055 N028 50
C46 N064 vout2x 3µ
R68 vout3x vout3x1 10
C47 vout3x 0 100p
C48 N014 0 4n
C49 N014 N021 30n
R69 N021 0 8
C50 N014 N022 30n
R70 N022 0 8
L4 N007 N014 5.6µ
R71 N007 N014 7.5
R72 0 N006 50
L5 0 N007 50µ
C51 N007 N006 0.25µ
C52 N027 vout1x 1µ
V4 N034 0 AC 1
XU2 Vc N005 vout4x Vp 0 NC_12 LTC6268-10
R6 N018 N005 2.53k
C4 N018 N017 1.32µ
R7 N012 N005 653
R8 vout4x N005 66k
C13 vout4x N012 50n
V6 NC_13 0 AC 1
R19 N005 Vc 50
XU4 Vc N030 vout5x Vp 0 NC_14 LTC6268-10
R20 N047 N030 830
C14 N047 vout4x 1.91n
R21 N043 N030 1000
R22 N036 N030 100k
C15 N036 N043 500p
V8 NC_15 0 AC 1
R23 N030 Vc 150
R24 N030 N029 100k
R25 N033 N030 13.16k
C16 N033 vout4x 30.24n
R26 N038 N030 5.24k
C17 N038 vout4x 12.04n
R27 N044 N030 2.09k
C18 N044 vout4x 4.79n
R28 N050 N030 331
C19 N050 vout4x 760p
R33 N053 N030 132
C20 N053 vout4x 302p
C21 N056 vout4x 200p
XU6 Vc N059 vout6x1 Vp 0 NC_16 LTC6268-10
R34 N065 N059 1.67k
R35 N062 N059 2.04k
R36 vout6x1 N059 73.8k
C23 vout6x1 N062 60p
V9 NC_17 0 AC 1
R37 N059 Vc 150
R38 N056 N030 50
C25 N065 vout5x 3µ
R40 vout6x vout6x1 10
C26 vout6x 0 100p
C30 N017 0 4n
C31 N017 N023 30n
R45 N023 0 8
C32 N017 N024 30n
R46 N024 0 8
L2 N009 N017 5.6µ
R47 N009 N017 7.5
R48 0 N008 50
L6 0 N009 50µ
C53 N009 N008 0.25µ
C54 N029 vout4x 0.1µ
V13 N036 0 AC 1
.ac dec 100 10 2000MEG
.param Vp=5
.param Vc=2.5
.ic V(vout2x)=2.5
* 2.55k
* 649
* 66.5k
* 47n + 3.3n = 50.3n
* 100p + 100p = 200p
* 665
* 49.9k
* 13.3k
* 5.23k
* 2.1k
* 825
* 332
* 137
* 59
* 27n + 3.3n = 30.3n
* 12n
* 2.4n + 2.4n = 4.8n
* 1.1n + 820p = 1.92n
* 300p + 470p = 770p
* 300p
* 1.69k
* 2.1k
* 30p + 30p=60p
* 73.2k
* 0.33uF x 4 = 1.32uF
.ic V(vout5x)=2.5
.lib LTC2.lib
.backanno
.end